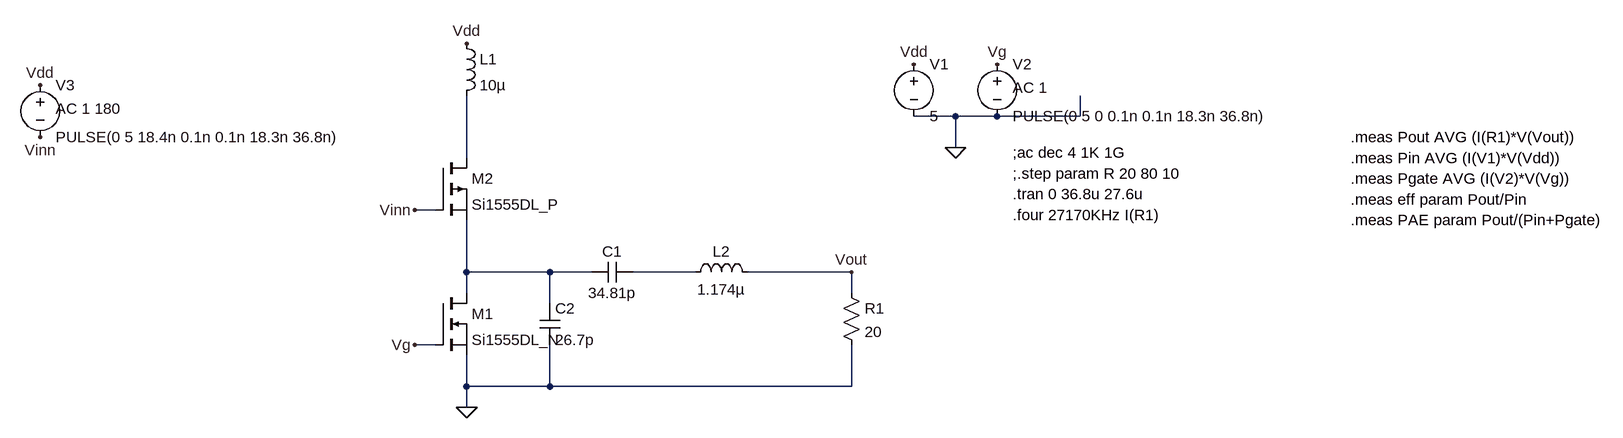
[diagram p0: schematic ClassDE.asc]
ClassDE.asc, the LTspice schematic file:
Version 4
SHEET 1 1244 680
WIRE 96 -16 32 -16
WIRE 160 -16 96 -16
WIRE 288 -16 288 -48
WIRE 288 -16 160 -16
WIRE 96 32 96 -16
WIRE -656 48 -656 -48
WIRE -704 128 -736 128
WIRE -656 224 -656 144
WIRE -528 224 -656 224
WIRE -464 224 -528 224
WIRE -304 224 -400 224
WIRE -64 224 -224 224
WIRE -656 256 -656 224
WIRE -64 256 -64 224
WIRE -528 272 -528 224
WIRE -704 336 -736 336
WIRE -656 400 -656 352
WIRE -528 400 -528 336
WIRE -528 400 -656 400
WIRE -64 400 -64 336
WIRE -64 400 -528 400
WIRE -656 432 -656 400
FLAG -656 432 0
FLAG 96 32 0
FLAG 32 -96 Vdd
FLAG -656 -128 Vdd
FLAG 160 -96 Vg
FLAG -736 336 Vg
FLAG -1312 16 Vinn
FLAG -736 128 Vinn
FLAG -64 224 Vout
FLAG -1312 -64 Vdd
SYMBOL ind -672 -144 R0
SYMATTR InstName L1
SYMATTR Value 10µ
SYMBOL voltage 32 -112 R0
WINDOW 123 0 0 Left 0
WINDOW 39 0 0 Left 0
SYMATTR InstName V1
SYMATTR Value 5
SYMBOL voltage 160 -112 R0
WINDOW 123 24 52 Left 2
WINDOW 39 0 0 Left 0
SYMATTR Value2 AC 1
SYMATTR InstName V2
SYMATTR Value PULSE(0 5 0 0.1n 0.1n 18.3n 36.8n)
SYMBOL ind -320 240 R270
WINDOW 0 32 56 VTop 2
WINDOW 3 5 56 VBottom 2
SYMATTR InstName L2
SYMATTR Value 1.174µ
SYMATTR SpiceLine Rser=0.1
SYMBOL cap -400 208 R90
WINDOW 0 0 32 VBottom 2
WINDOW 3 32 32 VTop 2
SYMATTR InstName C1
SYMATTR Value 34.81p
SYMATTR SpiceLine Rser=0.1
SYMBOL res -80 240 R0
SYMATTR InstName R1
SYMATTR Value 20
SYMBOL voltage -1312 -80 R0
WINDOW 123 24 52 Left 2
WINDOW 39 0 0 Left 0
SYMATTR Value2 AC 1 180
SYMATTR InstName V3
SYMATTR Value PULSE(0 5 18.4n 0.1n 0.1n 18.3n 36.8n)
SYMBOL cap -544 272 R0
SYMATTR InstName C2
SYMATTR Value 26.7p
SYMBOL nmos -704 256 R0
SYMATTR InstName M1
SYMATTR Value Si1555DL_N
SYMBOL pmos -704 48 R0
SYMATTR InstName M2
SYMATTR Value Si1555DL_P
TEXT 184 40 Left 2 !;ac dec 4 1K 1G
TEXT 184 72 Left 2 !;.step param R 20 80 10
TEXT 184 104 Left 2 !.tran 0 36.8u 27.6u
TEXT 704 16 Left 2 !.meas Pout AVG (I(R1)*V(Vout))
TEXT 704 48 Left 2 !.meas Pin AVG (I(V1)*V(Vdd))
TEXT 704 112 Left 2 !.meas eff param Pout/Pin
TEXT 704 80 Left 2 !.meas Pgate AVG (I(V2)*V(Vg))
TEXT 704 144 Left 2 !.meas PAE param Pout/(Pin+Pgate)
TEXT 184 136 Left 2 !.four 27170KHz I(R1)

The netlist it stands for:
* ClassDE.asc
L1 Vdd N001 10µ
V1 Vdd 0 5
V2 Vg 0 PULSE(0 5 0 0.1n 0.1n 18.3n 36.8n) AC 1
L2 N003 Vout 1.174µ Rser=0.1
C1 N003 N002 34.81p Rser=0.1
R1 Vout 0 20
V3 Vdd Vinn PULSE(0 5 18.4n 0.1n 0.1n 18.3n 36.8n) AC 1 180
C2 N002 0 26.7p
M1 N002 Vg 0 0 Si1555DL_N
M2 N001 Vinn N002 N002 Si1555DL_P
.model NMOS NMOS
.model PMOS PMOS
.lib standard.mos
;ac dec 4 1K 1G
;.step param R 20 80 10
.tran 0 36.8u 27.6u
.meas Pout AVG (I(R1)*V(Vout))
.meas Pin AVG (I(V1)*V(Vdd))
.meas eff param Pout/Pin
.meas Pgate AVG (I(V2)*V(Vg))
.meas PAE param Pout/(Pin+Pgate)
.four 27170KHz I(R1)
.backanno
.end